# EAGLE schematic placa_sensores (EAGLE 9.5.1)
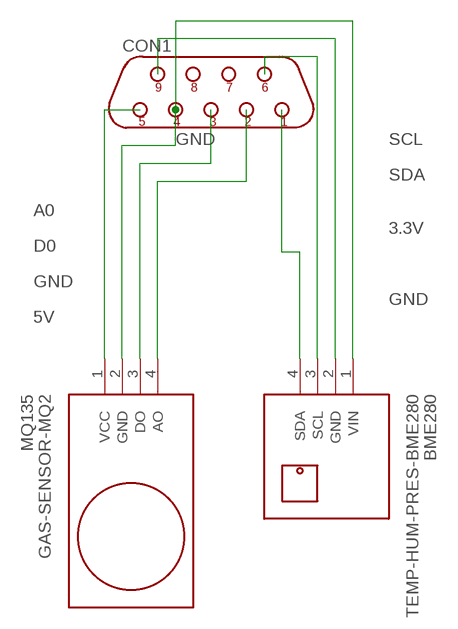
[diagram p0: schematic, sheet 1]

## Parts
BME280  TEMP-HUM-PRES-BME280  [TEMP-HUM-PRES-BME280]
CON1  DB9F  [D-09F]
MQ135  GAS-SENSOR-MQ2  [GAS-SENSOR-MQ2]

## Nets
3.3V: BME280.2(GND) CON1.9
5V: CON1.5 MQ135.1(VCC)
A0: CON1.2 MQ135.4(AO)
D0: CON1.3 MQ135.3(DO)
GND: BME280.1(VIN) CON1.4 MQ135.2(GND)
SCL: BME280.4(SDA) CON1.1
SDA: BME280.3(SCL) CON1.6
Unconnected: CON1.7 CON1.8

## Library data of the parts
BME280 = diy-modules:TEMP-HUM-PRES-BME280: Digital Humidity-Temperature-Pressure Sensor based on BME280 device More information about BME280 device is available here: https://www.bosch-sensortec.com/bst/products/all_products/bme280 Click here to find device on ebay.com <http://www.ebay.com/sch/bme280+breakout>
CON1 = connect:DB9F
MQ135 = diy-modules:GAS-SENSOR-MQ2: Gas Sensor based on MQ-2 device Guide describing how to use MQ-2 sensor with Arduino is available here: http://www.instructables.com/id/How-to-use-MQ2-Gas-Sensor-Arduino-Tutorial/ MQ-2 sensor datasheet is available here: http://gas-sensor.ru/pdf/combustible-gas-sensor.pdf Click here to find device on ebay.com <http://www.ebay.com/sch/mq2+sensor+module+smoke>